# Altium schematic sheet CAN.SchDoc
size C; SheetNumber: 3; SheetTotal: 4
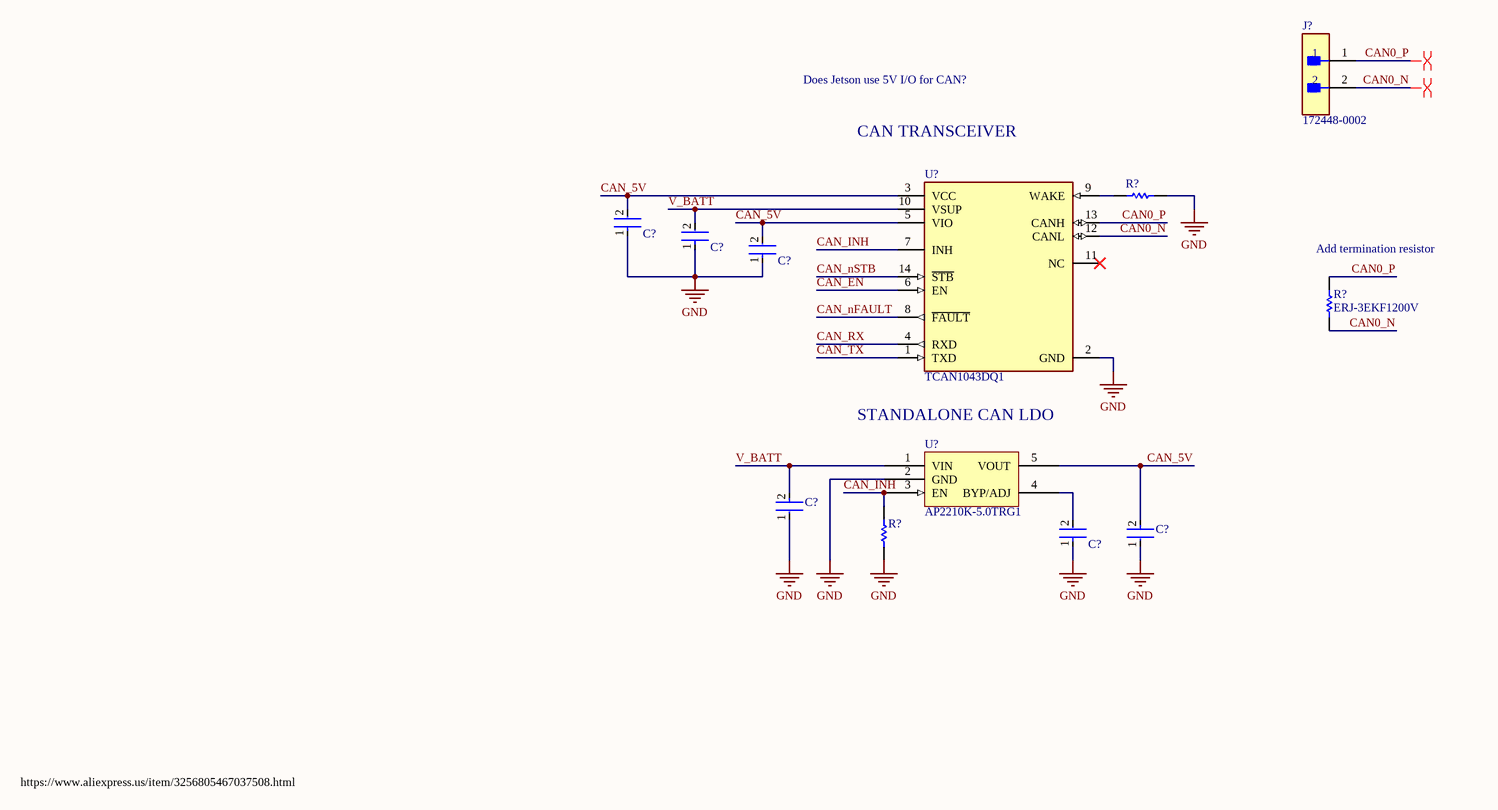
[diagram p0: CAN.SchDoc]

## Parts
(Parts that share a designator on the sheet are numbered #1, #2 ... from top to bottom, then left to right.)
C?#1  C0402C104K8PACTU  [FP-C0402-BB-MFG]  (value not drawn)
C?#2  C0402C104K8PACTU  [FP-C0402-BB-MFG]  (value not drawn)
C?#3  C0402C104K8PACTU  [FP-C0402-BB-MFG]  (value not drawn)
C?#4  C1608X5R1E225K080AB  [FP-C1608-080-0_1-MFG]  (value not drawn)
C?#5  C1608X5R1E225K080AB  [FP-C1608-080-0_1-MFG]  (value not drawn)
C?#6  C0402C104K8PACTU  [FP-C0402-BB-MFG]  (value not drawn)
J?  172448-0002  [FP-172448-0002-MFG]
R?#1  ERJ3EKF1002V  [RESC1609X55X30LL15T15]  (value not drawn)
R?#2  ERJ-3EKF1200V  [RESC1609X55X30ML15T15]
R?#3  ERJ3EKF1002V  [RESC1609X55X30LL15T15]  (value not drawn)
U?#1  TCAN1043DQ1  [FP-D0014A-C01-MFG]
U?#2  AP2210K-5.0TRG1  [SOT95P282X145-5N]

## Nets
GND: C?#1.1 C?#2.1 C?#3.1 C?#4.1 C?#5.1 C?#6.1 R?#1.1 R?#3.2 U?#1.2(GND) U?#2.2(GND)
CAN0_N: J?.2 R?#2.1 U?#1.12(CANL)
CAN0_P: J?.1 R?#2.2 U?#1.13(CANH)
CAN_5V: C?#1.2 C?#3.2 C?#5.2 U?#1.3(VCC) U?#1.5(VIO) U?#2.5(VOUT)
CAN_EN: U?#1.6(EN)
CAN_INH: R?#3.1 U?#1.7(INH) U?#2.3(EN)
CAN_nFAULT: U?#1.8(~{FAULT})
CAN_nSTB: U?#1.14(~{STB})
CAN_RX: U?#1.4(RXD)
CAN_TX: U?#1.1(TXD)
V_BATT: C?#2.2 C?#4.2 U?#1.10(VSUP) U?#2.1(VIN)
NetC?#6_2: C?#6.2 U?#2.4(BYP/ADJ)
NetR?#1_2: R?#1.2 U?#1.9(WAKE)

Not connected (* = marked no-connect by the designer): U?#1 11(NC)*

## Layout directives
differential pair: CAN0_N, CAN0_P

## Notes on the sheet
- Does Jetson use 5V I/O for CAN?
- CAN TRANSCEIVER
- (near R?#2) Add termination resistor
- (near U?#2) STANDALONE CAN LDO
- https://www.aliexpress.us/item/3256805467037508.html

## Library data of the parts
C?#1-C?#3 C?#6 = CMP-2008-02046-2: CAP CER 0.1UF 10V X5R 0402; Manufacturer: Kemet; Material: Ceramic; Capacitance: 0.10 μF; Temperature Coefficient: 15%; Tolerance: 0.1; Value: 0.10 μF; Package: C0402-BB; Temperature: -55°C to +125°C; ComponentLink2Description: Datasheet; Temperature Characteristic: X5R; Device Class L1: Passive Components; Height: 0.55mm; Lead Free: Yes; ComponentLink2URL: https://content.kemet.com/datasheets/KEM_C1002_X7R_SMD.pdf; Device Class L2: Capacitors; Temperature Range Low: -55°C; Temperature Range High: +125°C; RoHS: TRUE; Octopart: https://octopart.com/c0402c104k8pactu-kemet-140039; Automotive: No; Mouser Description: Capacitor 100 nF 10 VDC 0402; Category: Cap; Voltage Rating: 10 V; Digikey Description: CAP CER 0.1UF 10V X5R 0402; Ipc Land Pattern Name: CAPC10050X50; Device Class L3: Ceramic Capacitors; Manufacturer Part Number: C0402C104K8PACTU
C?#4 C?#5 = CMP-08246-003049-1: Multilayer Ceramic Capacitors 2.2μF ±10% 25V X5R SMD 0603; Capacitance: 2.2uF; Termination: SMD/SMT; Dielectric Material: Ceramic; REACH SVHC: No SVHC; Voltage Rating (DC): 25V; Voltage Rating: 25V; RoHS Compliant: Yes; Case Code (Imperial): 0603; Case/Package: 0603; Height: 0.8mm; Mount: Surface Mount; Min Operating Temperature: -55°C; Tolerance: 10%; Radiation Hardening: No; Dielectric: X5R; Depth: 0.8mm; Package Quantity: 4000; Length: 1.6mm; Weight: 7.1E-05oz; Resistor Type: Ceramic; Series: C; Thickness: 0.035inch; Width: 0.031inch; Case Code (Metric): 1608; Lead Free: Lead Free; Max Operating Temperature: 85°C; Packaging: Tape and Reel
J? = CMP-04780-000002-1: CONN HEADER R/A 2POS; Row Spacing: 0.165inch; Number of Circuits: 2; Connector Type: Male Pin; Glow Wire Compliant: Compliant; Number of Pins: 2; Mount: Through Hole; Number of Positions: 2; Number of Rows: 2; Color: Black; Contact Plating: Tin; Fastening Type: Ramp; Termination: Solder; RoHS Compliant: Yes; Packaging: Tray; Orientation: Right Angle
R?#1 R?#3 = CMP-1012-00623-3: Chip Resistor, 10 KOhm, +/- 1%, 0.1 W, -55 to 155 degC, 0603 (1608 Metric), RoHS, Tape and Reel; Manufacturer: Panasonic; Voltage Rating: 75V; Case\/Package: 0603; Power Rating: 100mW; Resistance: 10KOhm; Temperature Coefficient: 100ppm\/degreesC; Number of Pins: 2; Package Reference: 603; Depth: 0.8mm; Mount: SurfaceMount; Package Description: 2-Pin Surface Mount Device, Body 1.6 x 0.85 mm; Datasheet Version: 02/2017; Length: 1.6mm; Lead Free: LeadFree; Height: 0.45mm; Number of Terminations: 2; Max Power Dissipation: 100mW; Min Operating Temperature: -55degC; Datasheet URL: https://industrial.panasonic.com/cdbs/www-data/pdf/RDA0000/AOA0000C304.pdf; Termination: SMD/SMT; Case Code (Metric): 1608; Case Code (Imperial): 0603; Tolerance: 1%; Max Operating Temperature: 155degC; RoHSCompliant: true; Voltage Rating (DC): 75V; Radiation Hardening: No; Packaging: TapeandReel; Composition: ThickFilm; Mounting Technology: SurfaceMount; Manufacturer URL: http://www.panasonic.com/; Width: 0.031inch; REACH SVHC: NoSVHC; Contact Plating: Tin; Military Standard: Not; Package Quantity: 1
R?#2 = CMP-2000-00213-2: Chip Resistor, 120 Ohm, +/- 1%, 0.1 W, -55 to 155 degC, 0603 (1608 Metric), RoHS, Tape and Reel; Manufacturer: Panasonic; Power Rating: 100mW; Voltage Rating (DC): 75V; Resistance: 120Ohm; Temperature Coefficient: 100ppm/degreesC; Number of Terminations: 2; Military Standard: Not; Tolerance: 1%; Min Operating Temperature: -55degC; Packaging: TapeandReel; Lead Free: LeadFree; Max Operating Temperature: 155degC; Manufacturer URL: http://www.panasonic.com/; Case Code (Imperial): 0603; REACH SVHC: NoSVHC; Width: 0.031inch; Datasheet URL: https://industrial.panasonic.com/cdbs/www-data/pdf/RDA0000/AOA0000C283.pdf; RoHSCompliant: true; Max Power Dissipation: 100mW; Termination: SMD/SMT; Package Reference: 0603; Height: 0.022inch; Depth: 0.8mm; Package Description: 2-Pin Surface Mount Device, Body 1.6 x 0.85 mm; Contact Plating: Tin; Length: 1.6mm; Package URL: http://www.st.com/st-web-ui/static/active/en/resource/technical/document/datasheet/CD00001320.pdf; Radiation Hardening: No; Package Quantity: 1; Number of Pins: 2; Datasheet Version: 42095.0; Voltage Rating: 75V; Composition: ThickFilm; Case/Package: 0603; Mount: SurfaceMount; Case Code (Metric): 1608
U?#1 = CMP-04872-000219-1: IC TRANSCEIVER 1/1 14SOIC; Data Rate: 2Mbps; Receiver Hysteresis: 50mV; RoHS Compliant: Yes; Min Operating Temperature: -40°C; Case/Package: SOIC; Mount: Surface Mount; Max Operating Temperature: 125°C; Packaging: Rail/Tube
U?#2 = CMP-019-00058-1: IC REG LDO 5V 0.3A SOT25